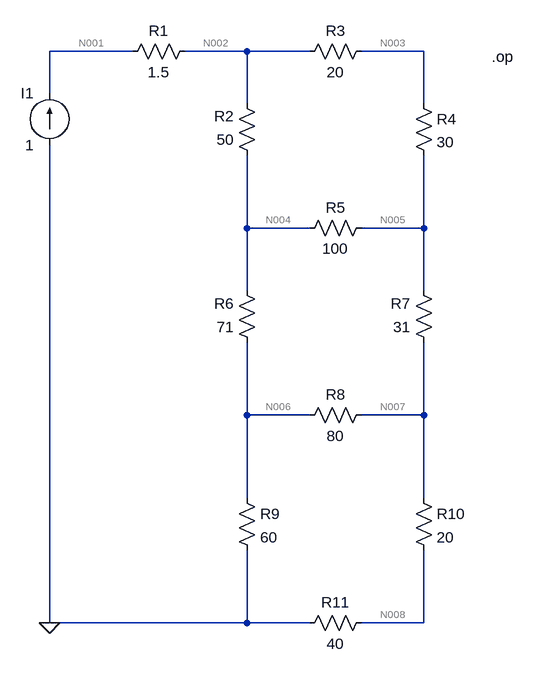
[diagram p0: schematic Lab07P01C.asc]
Lab07P01C.asc, the LTspice schematic file:
Version 4
SHEET 1 3060 992
WIRE 224 32 96 32
WIRE 400 32 304 32
WIRE 496 32 400 32
WIRE 672 32 576 32
WIRE 96 96 96 32
WIRE 400 112 400 32
WIRE 672 112 672 32
WIRE 400 304 400 192
WIRE 496 304 400 304
WIRE 672 304 672 192
WIRE 672 304 576 304
WIRE 400 400 400 304
WIRE 672 400 672 304
WIRE 400 592 400 480
WIRE 496 592 400 592
WIRE 672 592 672 480
WIRE 672 592 576 592
WIRE 400 720 400 592
WIRE 672 720 672 592
WIRE 96 912 96 176
WIRE 400 912 400 800
WIRE 400 912 96 912
WIRE 496 912 400 912
WIRE 672 912 672 800
WIRE 672 912 576 912
FLAG 96 912 0
DATAFLAG 96 32 ""
SYMBOL current 96 176 R180
WINDOW 0 24 80 Left 2
WINDOW 3 24 0 Left 2
SYMATTR InstName I1
SYMATTR Value 1
SYMBOL res 320 16 R90
WINDOW 0 0 56 VBottom 2
WINDOW 3 32 56 VTop 2
SYMATTR InstName R1
SYMATTR Value 1.5
SYMBOL res 416 208 R180
WINDOW 0 36 76 Left 2
WINDOW 3 36 40 Left 2
SYMATTR InstName R2
SYMATTR Value 50
SYMBOL res 480 48 R270
WINDOW 0 32 56 VTop 2
WINDOW 3 0 56 VBottom 2
SYMATTR InstName R3
SYMATTR Value 20
SYMBOL res 656 96 R0
SYMATTR InstName R4
SYMATTR Value 30
SYMBOL res 592 288 R90
WINDOW 0 0 56 VBottom 2
WINDOW 3 32 56 VTop 2
SYMATTR InstName R5
SYMATTR Value 100
SYMBOL res 416 496 R180
WINDOW 0 36 76 Left 2
WINDOW 3 36 40 Left 2
SYMATTR InstName R6
SYMATTR Value 71
SYMBOL res 688 496 R180
WINDOW 0 36 76 Left 2
WINDOW 3 36 40 Left 2
SYMATTR InstName R7
SYMATTR Value 31
SYMBOL res 592 576 R90
WINDOW 0 0 56 VBottom 2
WINDOW 3 32 56 VTop 2
SYMATTR InstName R8
SYMATTR Value 80
SYMBOL res 384 704 R0
SYMATTR InstName R9
SYMATTR Value 60
SYMBOL res 656 704 R0
SYMATTR InstName R10
SYMATTR Value 20
SYMBOL res 592 896 R90
WINDOW 0 0 56 VBottom 2
WINDOW 3 32 56 VTop 2
SYMATTR InstName R11
SYMATTR Value 40
TEXT 776 40 Left 2 !.op

The netlist it stands for:
* Lab07P01C.asc
I1 0 N001 1
R1 N002 N001 1.5
R2 N004 N002 50
R3 N002 N003 20
R4 N003 N005 30
R5 N005 N004 100
R6 N006 N004 71
R7 N007 N005 31
R8 N007 N006 80
R9 N006 0 60
R10 N007 N008 20
R11 N008 0 40
.op
.backanno
.end

* Results of the author's LTspice run, read from the files saved beside the schematic
* Operating Point:
*   V(n001) = 80 V
*   V(n002) = 78.5 V
*   V(n004) = 56 V
*   V(n003) = 67.5 V
*   V(n005) = 51 V
*   V(n006) = 27.6 V
*   V(n007) = 32.4 V
*   V(n008) = 21.6 V
*   I(I1) = 1 A
*   I(R1) = -1 A
*   I(R2) = -450 mA
*   I(R3) = 550 mA
*   I(R4) = 550 mA
*   I(R5) = -50 mA
*   I(R6) = -400 mA
*   I(R7) = -600 mA
*   I(R8) = 60 mA
*   I(R9) = 460 mA
*   I(R10) = 540 mA
*   I(R11) = 540 mA